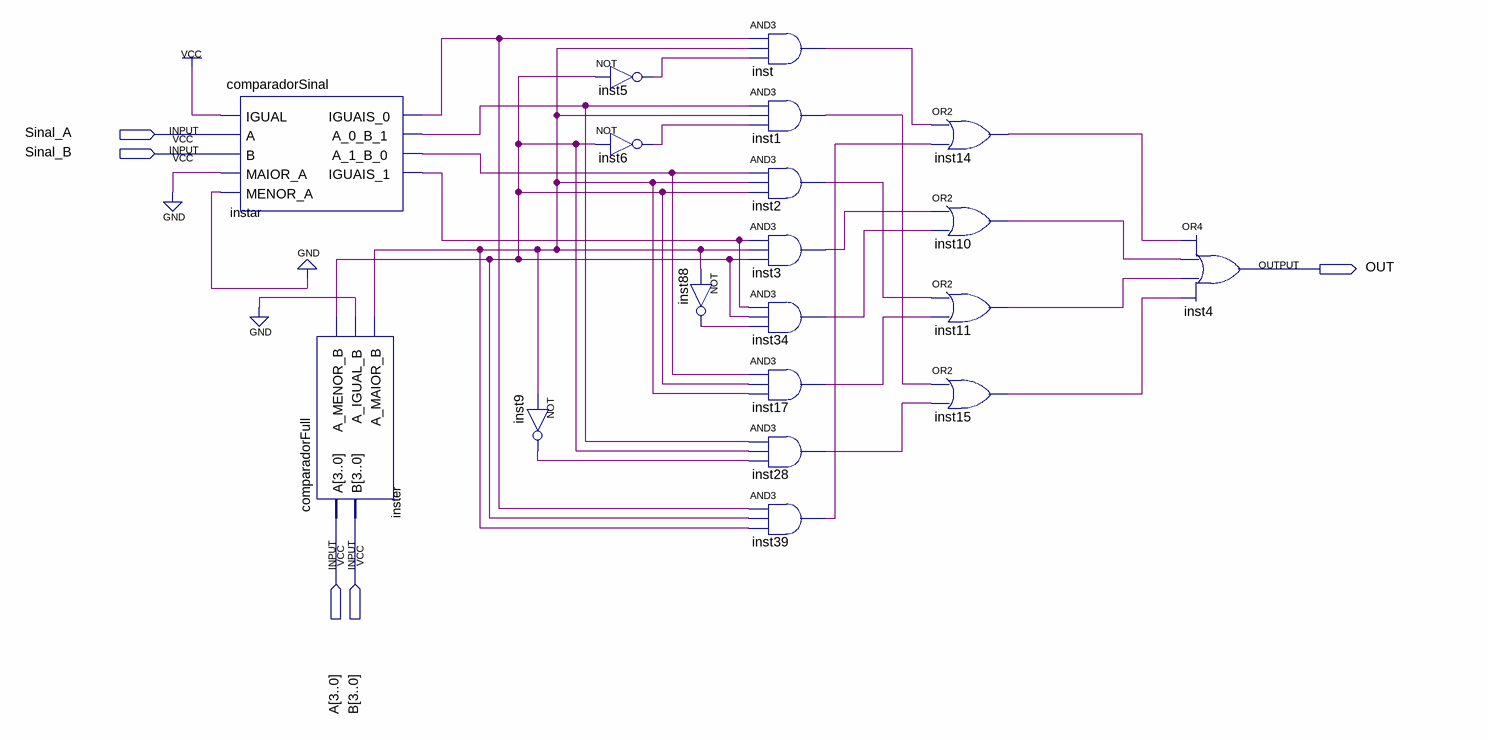
[diagram p0: schematic sheet]
// Quartus schematic comparadorMaior.bdf as structural Verilog: 19 symbols, 5 pins
module comparadorMaior (
  input  Sinal_A,
  input  Sinal_B,
  input  [3:0] A,
  input  [3:0] B,
  output OUT
);

  wire inst1_out, inst2_out, inst3_out, inst5_out, inst6_out, inst9_out, inst10_out, inst11_out, inst14_out,
       inst15_out, inst17_out, inst28_out, inst34_out, inst39_out, inst88_out, inst_out, instar_a_0_b_1,
       instar_a_1_b_0, instar_iguais_0, instar_iguais_1, inster_a_igual_b, inster_a_maior_b, inster_a_menor_b;

  comparadorSinal instar (
    .IGUAL(1'b1), .A(Sinal_A), .B(Sinal_B), .MAIOR_A(1'b0), .MENOR_A(1'b0), .IGUAIS_0(instar_iguais_0),
    .A_0_B_1(instar_a_0_b_1), .A_1_B_0(instar_a_1_b_0), .IGUAIS_1(instar_iguais_1));
  comparadorFull inster (
    .A(A), .B(B), .A_MENOR_B(inster_a_menor_b), .A_IGUAL_B(inster_a_igual_b), .A_MAIOR_B(inster_a_maior_b));
  not inst9 (inst9_out, inster_a_maior_b);
  not inst5 (inst5_out, inster_a_menor_b);
  not inst6 (inst6_out, inster_a_menor_b);
  not inst88 (inst88_out, inster_a_maior_b);
  and inst (inst_out, instar_iguais_0, inster_a_maior_b, inst5_out);
  and inst1 (inst1_out, instar_a_0_b_1, inster_a_maior_b, inst6_out);
  and inst2 (inst2_out, instar_a_1_b_0, inster_a_maior_b, inster_a_menor_b);
  and inst3 (inst3_out, instar_iguais_1, inster_a_maior_b, inster_a_menor_b);
  and inst34 (inst34_out, instar_iguais_1, inster_a_menor_b, inst88_out);
  and inst17 (inst17_out, instar_a_1_b_0, inster_a_menor_b, inster_a_maior_b);
  and inst28 (inst28_out, instar_a_0_b_1, inster_a_menor_b, inst9_out);
  and inst39 (inst39_out, instar_iguais_0, inster_a_menor_b, inster_a_maior_b);
  or inst14 (inst14_out, inst_out, inst39_out);
  or inst10 (inst10_out, inst3_out, inst34_out);
  or inst11 (inst11_out, inst2_out, inst17_out);
  or inst15 (inst15_out, inst1_out, inst28_out);
  or inst4 (OUT, inst14_out, inst10_out, inst11_out, inst15_out);
  // also tied to GND on the sheet: inster_a_igual_b
endmodule
